# EAGLE design ADIS16209 Practice Board (EAGLE 9.5.0)
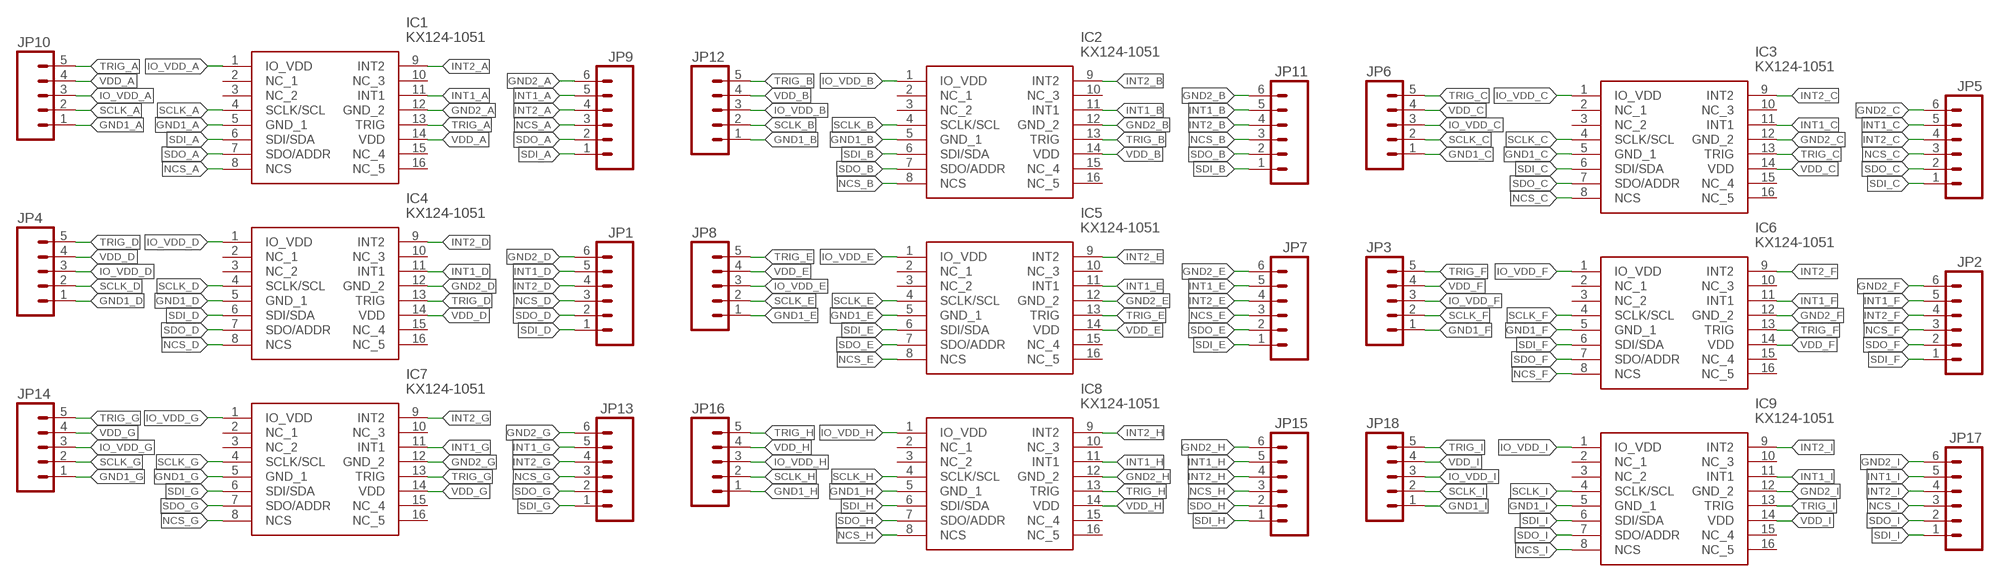
[diagram p0: schematic, sheet 1]

## Parts
IC1  KX124-1051  [3X3LGA]
IC2  KX124-1051  [3X3LGA]
IC3  KX124-1051  [3X3LGA]
IC4  KX124-1051  [3X3LGA]
IC5  KX124-1051  [3X3LGA]
IC6  KX124-1051  [3X3LGA]
IC7  KX124-1051  [3X3LGA]
IC8  KX124-1051  [3X3LGA]
IC9  KX124-1051  [3X3LGA]
JP1  M06  [1X06]
JP2  M06  [1X06]
JP3  M05  [1X05]
JP4  M05  [1X05]
JP5  M06  [1X06]
JP6  M05  [1X05]
JP7  M06  [1X06]
JP8  M05  [1X05]
JP9  M06  [1X06]
JP10  M05  [1X05]
JP11  M06  [1X06]
JP12  M05  [1X05]
JP13  M06  [1X06]
JP14  M05  [1X05]
JP15  M06  [1X06]
JP16  M05  [1X05]
JP17  M06  [1X06]
JP18  M05  [1X05]

## Nets
GND1_A: IC1.5(GND_1) JP10.1
GND1_B: IC2.5(GND_1) JP12.1
GND1_C: IC3.5(GND_1) JP6.1
GND1_D: IC4.5(GND_1) JP4.1
GND1_E: IC5.5(GND_1) JP8.1
GND1_F: IC6.5(GND_1) JP3.1
GND1_G: IC7.5(GND_1) JP14.1
GND1_H: IC8.5(GND_1) JP16.1
GND1_I: IC9.5(GND_1) JP18.1
GND2_A: IC1.12(GND_2) JP9.6
GND2_B: IC2.12(GND_2) JP11.6
GND2_C: IC3.12(GND_2) JP5.6
GND2_D: IC4.12(GND_2) JP1.6
GND2_E: IC5.12(GND_2) JP7.6
GND2_F: IC6.12(GND_2) JP2.6
GND2_G: IC7.12(GND_2) JP13.6
GND2_H: IC8.12(GND_2) JP15.6
GND2_I: IC9.12(GND_2) JP17.6
INT1_A: IC1.11(INT1) JP9.5
INT1_B: IC2.11(INT1) JP11.5
INT1_C: IC3.11(INT1) JP5.5
INT1_D: IC4.11(INT1) JP1.5
INT1_E: IC5.11(INT1) JP7.5
INT1_F: IC6.11(INT1) JP2.5
INT1_G: IC7.11(INT1) JP13.5
INT1_H: IC8.11(INT1) JP15.5
INT1_I: IC9.11(INT1) JP17.5
INT2_A: IC1.9(INT2) JP9.4
INT2_B: IC2.9(INT2) JP11.4
INT2_C: IC3.9(INT2) JP5.4
INT2_D: IC4.9(INT2) JP1.4
INT2_E: IC5.9(INT2) JP7.4
INT2_F: IC6.9(INT2) JP2.4
INT2_G: IC7.9(INT2) JP13.4
INT2_H: IC8.9(INT2) JP15.4
INT2_I: IC9.9(INT2) JP17.4
IO_VDD_A: IC1.1(IO_VDD) JP10.3
IO_VDD_B: IC2.1(IO_VDD) JP12.3
IO_VDD_C: IC3.1(IO_VDD) JP6.3
IO_VDD_D: IC4.1(IO_VDD) JP4.3
IO_VDD_E: IC5.1(IO_VDD) JP8.3
IO_VDD_F: IC6.1(IO_VDD) JP3.3
IO_VDD_G: IC7.1(IO_VDD) JP14.3
IO_VDD_H: IC8.1(IO_VDD) JP16.3
IO_VDD_I: IC9.1(IO_VDD) JP18.3
NCS_A: IC1.8(NCS) JP9.3
NCS_B: IC2.8(NCS) JP11.3
NCS_C: IC3.8(NCS) JP5.3
NCS_D: IC4.8(NCS) JP1.3
NCS_E: IC5.8(NCS) JP7.3
NCS_F: IC6.8(NCS) JP2.3
NCS_G: IC7.8(NCS) JP13.3
NCS_H: IC8.8(NCS) JP15.3
NCS_I: IC9.8(NCS) JP17.3
SCLK_A: IC1.4(SCLK/SCL) JP10.2
SCLK_B: IC2.4(SCLK/SCL) JP12.2
SCLK_C: IC3.4(SCLK/SCL) JP6.2
SCLK_D: IC4.4(SCLK/SCL) JP4.2
SCLK_E: IC5.4(SCLK/SCL) JP8.2
SCLK_F: IC6.4(SCLK/SCL) JP3.2
SCLK_G: IC7.4(SCLK/SCL) JP14.2
SCLK_H: IC8.4(SCLK/SCL) JP16.2
SCLK_I: IC9.4(SCLK/SCL) JP18.2
SDI_A: IC1.6(SDI/SDA) JP9.1
SDI_B: IC2.6(SDI/SDA) JP11.1
SDI_C: IC3.6(SDI/SDA) JP5.1
SDI_D: IC4.6(SDI/SDA) JP1.1
SDI_E: IC5.6(SDI/SDA) JP7.1
SDI_F: IC6.6(SDI/SDA) JP2.1
SDI_G: IC7.6(SDI/SDA) JP13.1
SDI_H: IC8.6(SDI/SDA) JP15.1
SDI_I: IC9.6(SDI/SDA) JP17.1
SDO_A: IC1.7(SDO/ADDR) JP9.2
SDO_B: IC2.7(SDO/ADDR) JP11.2
SDO_C: IC3.7(SDO/ADDR) JP5.2
SDO_D: IC4.7(SDO/ADDR) JP1.2
SDO_E: IC5.7(SDO/ADDR) JP7.2
SDO_F: IC6.7(SDO/ADDR) JP2.2
SDO_G: IC7.7(SDO/ADDR) JP13.2
SDO_H: IC8.7(SDO/ADDR) JP15.2
SDO_I: IC9.7(SDO/ADDR) JP17.2
TRIG_A: IC1.13(TRIG) JP10.5
TRIG_B: IC2.13(TRIG) JP12.5
TRIG_C: IC3.13(TRIG) JP6.5
TRIG_D: IC4.13(TRIG) JP4.5
TRIG_E: IC5.13(TRIG) JP8.5
TRIG_F: IC6.13(TRIG) JP3.5
TRIG_G: IC7.13(TRIG) JP14.5
TRIG_H: IC8.13(TRIG) JP16.5
TRIG_I: IC9.13(TRIG) JP18.5
VDD_A: IC1.14(VDD) JP10.4
VDD_B: IC2.14(VDD) JP12.4
VDD_C: IC3.14(VDD) JP6.4
VDD_D: IC4.14(VDD) JP4.4
VDD_E: IC5.14(VDD) JP8.4
VDD_F: IC6.14(VDD) JP3.4
VDD_G: IC7.14(VDD) JP14.4
VDD_H: IC8.14(VDD) JP16.4
VDD_I: IC9.14(VDD) JP18.4
Unconnected: IC1.2(NC_1) IC1.3(NC_2) IC1.10(NC_3) IC1.15(NC_4) IC1.16(NC_5) IC2.2(NC_1) IC2.3(NC_2) IC2.10(NC_3) IC2.15(NC_4) IC2.16(NC_5) IC3.2(NC_1) IC3.3(NC_2) IC3.10(NC_3) IC3.15(NC_4) IC3.16(NC_5) IC4.2(NC_1) IC4.3(NC_2) IC4.10(NC_3) IC4.15(NC_4) IC4.16(NC_5) IC5.2(NC_1) IC5.3(NC_2) IC5.10(NC_3) IC5.15(NC_4) IC5.16(NC_5) IC6.2(NC_1) IC6.3(NC_2) IC6.10(NC_3) IC6.15(NC_4) IC6.16(NC_5) IC7.2(NC_1) IC7.3(NC_2) IC7.10(NC_3) IC7.15(NC_4) IC7.16(NC_5) IC8.2(NC_1) IC8.3(NC_2) IC8.10(NC_3) IC8.15(NC_4) IC8.16(NC_5) IC9.2(NC_1) IC9.3(NC_2) IC9.10(NC_3) IC9.15(NC_4) IC9.16(NC_5)

## Library data of the parts
IC1-IC9 = samacsys:KX124-1051: TRI-AXIS, USER SELECTABLE +/- 2G, 4G, 8G, DIGITAL (I2C/SPI) OUTPUT, INTEGRATED FIFO/FILO BUFFER, 3X3X0.9MM LGA - KX124-1051 Source: Datasheet <https://drive.google.com/open?id=0B2DMAzfTCVsPTnd2TVZQWHJTTlU>; DESCRIPTION: TRI-AXIS, USER SELECTABLE +/- 2G, 4G, 8G, DIGITAL (I2C/SPI) OUTPUT, INTEGRATED FIFO/FILO BUFFER, 3X3X0.9MM LGA - KX124-1051; HEIGHT: mm; MANUFACTURER_NAME: Kionix; MANUFACTURER_PART_NUMBER: KX124-1051; MOUSER_PART_NUMBER: 912-KX124-1051-FR; MOUSER_PRICE-STOCK: https://www.mouser.com/Search/Refine.aspx?Keyword=912-KX124-1051-FR
JP1 JP2 JP5 JP7 JP9 JP11 JP13 JP15 JP17 = HyTechDevices:M06: Standard 6-pin 0.1" header. NOTES ON THE VARIANTS LOCK and LOCK_LONGPADS... This footprint was designed to help hold the alignment of a through-hole component (i.e. 6-pin header) while soldering it into place. You may notice that each hole has been shifted either up or down by 0.005 of an inch from it's more standard position (which is a perfectly straight line). This slight alteration caused the pins (the squares in the middle) to touch the edges of the holes. Because they are alternating, it causes a "brace" to hold the component in place. 0.005 has proven to be the perfect amount of "off-center" position when using our standard breakaway headers. Although looks a little odd when you look at the bare footprint, once you have a header in there, the alteration is very hard to notice. Also,if you push a header all the way into place, it is covered up entirely on the bottom side. This idea of altering the position of holes to aid alignment will be further integrated into the Sparkfun Library for other footprints. It can help hold any component with 3 or more connection pins. Note: The Sparkfun version includes many other packages including surface mount that may be of future interest. Source: Sparkfun <https://github.com/sparkfun/SparkFun-Eagle-Libraries>
JP3 JP4 JP6 JP8 JP10 JP12 JP14 JP16 JP18 = HyTechDevices:M05: Standard 5-pin 0.1" header. NOTES ON THE VARIANTS LOCK and LOCK_LONGPADS... This footprint was designed to help hold the alignment of a through-hole component (i.e. 5-pin header) while soldering it into place. You may notice that each hole has been shifted either up or down by 0.005 of an inch from it's more standard position (which is a perfectly straight line). This slight alteration caused the pins (the squares in the middle) to touch the edges of the holes. Because they are alternating, it causes a "brace" to hold the component in place. 0.005 has proven to be the perfect amount of "off-center" position when using our standard breakaway headers. Although looks a little odd when you look at the bare footprint, once you have a header in there, the alteration is very hard to notice. Also,if you push a header all the way into place, it is covered up entirely on the bottom side. This idea of altering the position of holes to aid alignment will be further integrated into the Sparkfun Library for other footprints. It can help hold any component with 3 or more connection pins. Note: The Sparkfun version includes many other packages including surface mount that may be of future interest. Source: Sparkfun <https://github.com/sparkfun/SparkFun-Eagle-Libraries>

## Board
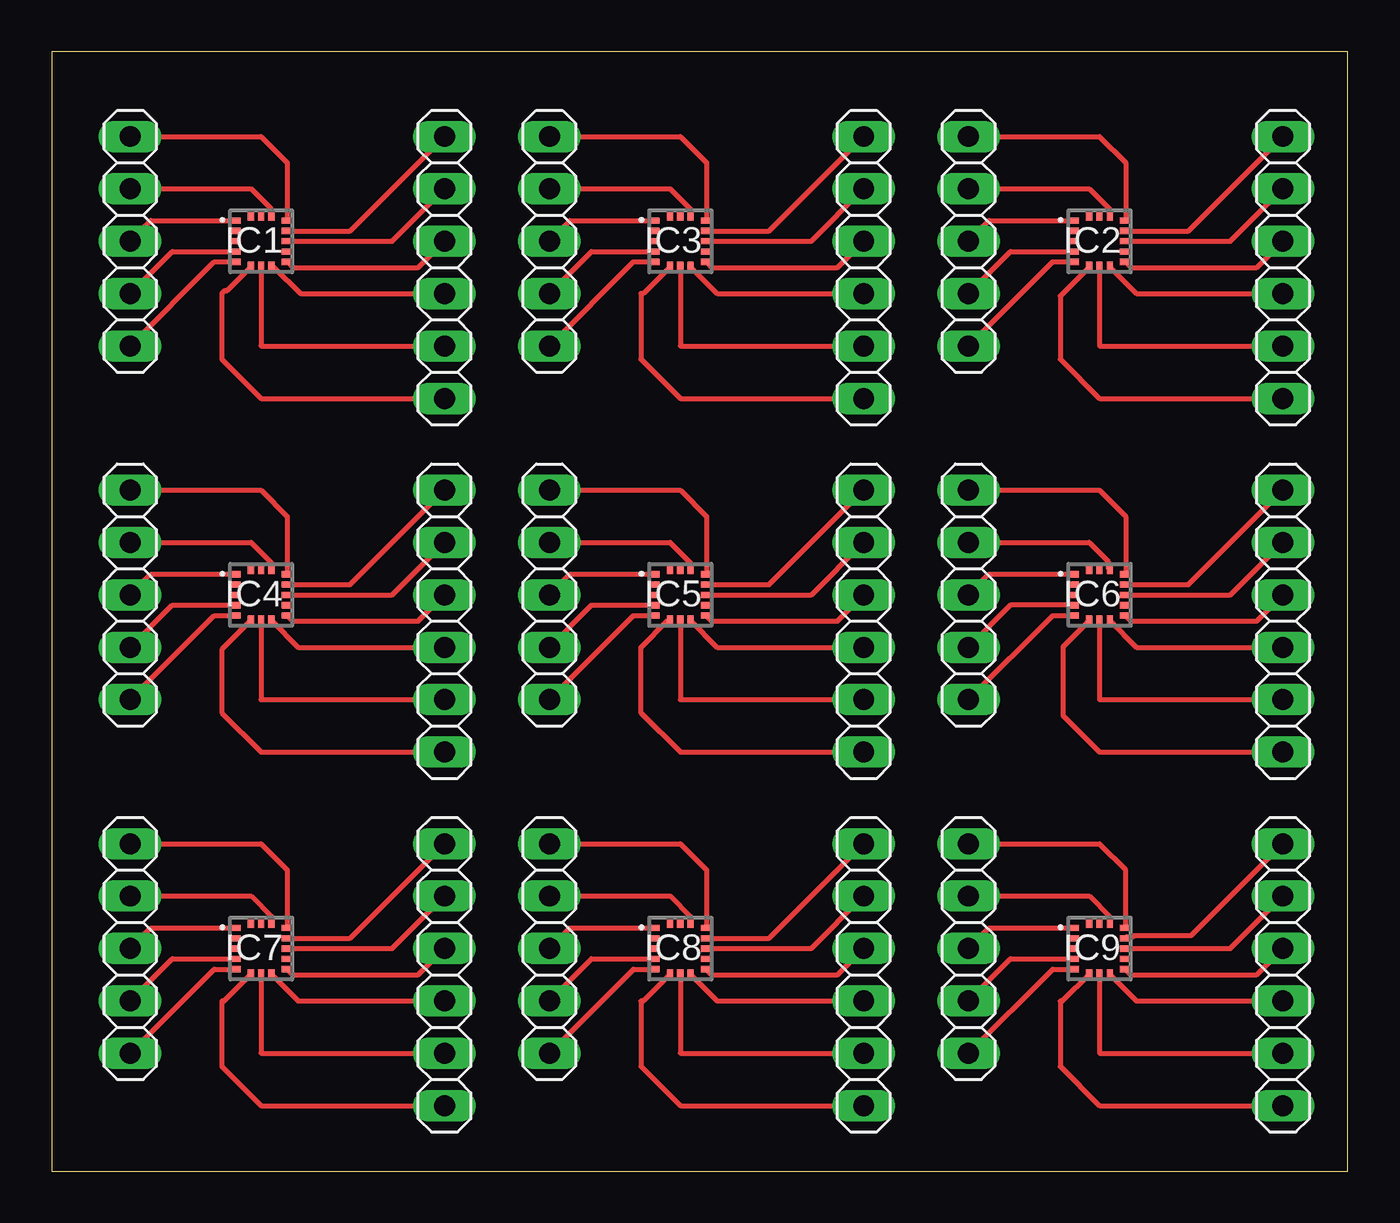
[diagram p1: board, top side]

Size 62.84 x 54.28 mm. Coordinates in mm from the lower left corner, seen from the top.
Outline: 0,0 62.84,0 62.84,54.28 0,54.28 0,0
Copper layers (1*16): Top 0.035mm / dielectric 1.5mm / Bottom 0.035mm
Design rules "DRC Advanced Circuits": minimum track width 6mil, minimum drill 10mil, track to track 6mil, track to pad 6mil, pad to pad 6mil, via to via 6mil, smd to smd 6mil, copper to edge 40mil, drill to drill 6mil, minimum pad ring 10mil, minimum via ring 8mil, stop-mask expansion 4mil, vias tented up to drill 0mil, thermal gap 10mil

### Footprints (pad centres in the part's own frame; a part is rotated, then mirrored left to right if it is on the bottom)
3X3LGA = smd 0.5 x 0.3: 1 -1.25,1; 2 -1.25,0.5; 3 -1.25,0; 4 -1.25,-0.5; 5 -1.25,-1; 9 1.25,-1; 10 1.25,-0.5; 11 1.25,0; 12 1.25,0.5; 13 1.25,1 | smd 0.3 x 0.5: 6 -0.5,-1.25; 7 0,-1.25; 8 0.5,-1.25; 14 0.5,1.25; 15 0,1.25; 16 -0.5,1.25
1X06 = drill 1.016 long: 1 -6.35,0; 2 -3.81,0; 3 -1.27,0; 4 1.27,0; 5 3.81,0; 6 6.35,0
1X05 = drill 1.016 long: 1 -5.08,0; 2 -2.54,0; 3 0,0; 4 2.54,0; 5 5.08,0

### Placement (x,y rotation side)
IC1  10.16,45.09 0 top
IC2  50.8,45.09 0 top
IC3  30.48,45.09 0 top
IC4  10.16,27.94 0 top
IC5  30.48,27.94 0 top
IC6  50.8,27.94 0 top
IC7  10.16,10.8 0 top
IC8  30.48,10.8 0 top
IC9  50.8,10.8 0 top
JP1  19.05,26.67 90 top
JP2  59.69,26.67 90 top
JP3  44.45,27.94 90 top
JP4  3.81,27.94 90 top
JP5  39.37,43.81 90 top
JP6  24.13,45.09 90 top
JP7  39.37,26.67 90 top
JP8  24.13,27.94 90 top
JP9  19.05,43.81 90 top
JP10  3.81,45.09 90 top
JP11  59.69,43.81 90 top
JP12  44.45,45.09 90 top
JP13  19.05,9.52 90 top
JP14  3.81,10.8 90 top
JP15  39.37,9.52 90 top
JP16  24.13,10.8 90 top
JP17  59.69,9.52 90 top
JP18  44.45,10.8 90 top

### Tracks (layer width: path | path; a pad name or v marks a point on that pad's centre or on a via)
GND1_A
  Top 0.254: JP10.1 7.89,44.09 IC1.5
GND1_B
  Top 0.254: JP12.1 48.53,44.09 IC2.5
GND1_C
  Top 0.254: JP6.1 28.21,44.09 IC3.5
GND1_D
  Top 0.254: JP4.1 7.89,26.94 IC4.5
GND1_E
  Top 0.254: JP8.1 28.21,26.94 IC5.5
GND1_F
  Top 0.254: JP3.1 48.53,26.94 IC6.5
GND1_G
  Top 0.254: JP14.1 7.89,9.8 IC7.5
GND1_H
  Top 0.254: JP16.1 28.21,9.8 IC8.5
GND1_I
  Top 0.254: JP18.1 48.53,9.8 IC9.5
GND2_A
  Top 0.254: IC1.12 14.47,45.59 JP9.6
GND2_B
  Top 0.254: IC2.12 55.11,45.59 JP11.6
GND2_C
  Top 0.254: IC3.12 34.79,45.59 JP5.6
GND2_D
  Top 0.254: IC4.12 14.47,28.44 JP1.6
GND2_E
  Top 0.254: IC5.12 34.79,28.44 JP7.6
GND2_F
  Top 0.254: JP2.6 55.11,28.44 IC6.12
GND2_G
  Top 0.254: IC7.12 14.47,11.3 JP13.6
GND2_H
  Top 0.254: IC8.12 34.79,11.3 JP15.6
GND2_I
  Top 0.254: IC9.12 52.12,11.37 52.42,11.37 52.48,11.43 55.25,11.43 JP17.6
INT1_A
  Top 0.254: JP9.5 16.51,45.09 IC1.11
INT1_B
  Top 0.254: IC2.11 57.15,45.09 JP11.5
INT1_C
  Top 0.254: IC3.11 36.83,45.09 JP5.5
INT1_D
  Top 0.254: IC4.11 16.51,27.94 JP1.5
INT1_E
  Top 0.254: IC5.11 36.83,27.94 JP7.5
INT1_F
  Top 0.254: JP2.5 57.15,27.94 IC6.11
INT1_G
  Top 0.254: IC7.11 16.51,10.8 JP13.5
INT1_H
  Top 0.254: IC8.11 36.83,10.8 JP15.5
INT1_I
  Top 0.254: IC9.11 57.15,10.8 JP17.5
INT2_A
  Top 0.254: IC1.9 11.68,43.81 17.78,43.81 JP9.4
INT2_B
  Top 0.254: IC2.9 52.32,43.81 58.42,43.81 JP11.4
INT2_C
  Top 0.254: IC3.9 32,43.81 38.1,43.81 JP5.4
INT2_D
  Top 0.254: IC4.9 11.68,26.67 17.78,26.67 JP1.4
INT2_E
  Top 0.254: IC5.9 32,26.67 38.1,26.67 JP7.4
INT2_F
  Top 0.254: JP2.4 58.42,26.67 52.32,26.67 IC6.9
INT2_G
  Top 0.254: IC7.9 11.68,9.52 17.78,9.52 JP13.4
INT2_H
  Top 0.254: IC8.9 32,9.52 38.1,9.52 JP15.4
INT2_I
  Top 0.254: IC9.9 52.32,9.52 58.42,9.52 JP17.4
IO_VDD_A
  Top 0.254: JP10.3 4.81,46.09 IC1.1
IO_VDD_B
  Top 0.254: JP12.3 45.45,46.09 IC2.1
IO_VDD_C
  Top 0.254: JP6.3 25.13,46.09 IC3.1
IO_VDD_D
  Top 0.254: JP4.3 4.81,28.94 IC4.1
IO_VDD_E
  Top 0.254: JP8.3 25.13,28.94 IC5.1
IO_VDD_F
  Top 0.254: JP3.3 45.45,28.94 IC6.1
IO_VDD_G
  Top 0.254: JP14.3 4.81,11.8 IC7.1
IO_VDD_H
  Top 0.254: JP16.3 25.13,11.8 IC8.1
IO_VDD_I
  Top 0.254: JP18.3 45.45,11.8 IC9.1
NCS_A
  Top 0.254: IC1.8 10.78,43.84 12.06,42.55 JP9.3
NCS_B
  Top 0.254: IC2.8 52.59,42.55 JP11.3
NCS_C
  Top 0.254: IC3.8 32.27,42.55 JP5.3
NCS_D
  Top 0.254: IC4.8 11.95,25.4 JP1.3
NCS_E
  Top 0.254: IC5.8 32.27,25.4 JP7.3
NCS_F
  Top 0.254: IC6.8 52.59,25.4 JP2.3
NCS_G
  Top 0.254: IC7.8 11.95,8.25 JP13.3
NCS_H
  Top 0.254: IC8.8 32.27,8.25 JP15.3
NCS_I
  Top 0.254: IC9.8 52.59,8.25 JP17.3
SCLK_A
  Top 0.254: JP10.2 5.85,44.59 IC1.4
SCLK_B
  Top 0.254: JP12.2 46.49,44.59 IC2.4
SCLK_C
  Top 0.254: JP6.2 26.17,44.59 IC3.4
SCLK_D
  Top 0.254: JP4.2 5.85,27.44 IC4.4
SCLK_E
  Top 0.254: JP8.2 26.17,27.44 IC5.4
SCLK_F
  Top 0.254: IC6.4 46.49,27.44 JP3.2
SCLK_G
  Top 0.254: JP14.2 5.85,10.3 IC7.4
SCLK_H
  Top 0.254: JP16.2 26.17,10.3 IC8.4
SCLK_I
  Top 0.254: JP18.2 46.49,10.3 IC9.4
SDI_A
  Top 0.254: IC1.6 8.51,42.68 8.39,42.68 8.26,42.55 8.26,39.37 10.16,37.47 JP9.1
SDI_B
  Top 0.254: IC2.6 48.9,42.43 48.9,39.37 50.8,37.47 JP11.1
SDI_C
  Top 0.254: IC3.6 28.69,42.55 28.58,42.55 28.58,39.37 30.48,37.47 JP5.1
SDI_D
  Top 0.254: IC4.6 8.26,25.28 8.26,22.23 10.16,20.32 JP1.1
SDI_E
  Top 0.254: JP7.1 30.48,20.32 28.58,22.23 28.58,25.4 29.87,26.69 IC5.6
SDI_F
  Top 0.254: JP2.1 50.8,20.32 49.03,22.09 49.03,25.42 IC6.6
SDI_G
  Top 0.254: IC7.6 8.37,8.25 8.26,8.25 8.26,5.08 10.16,3.18 JP13.1
SDI_H
  Top 0.254: IC8.6 28.69,8.25 28.58,8.25 28.58,5.08 30.48,3.18 JP15.1
SDI_I
  Top 0.254: IC9.6 49.01,8.25 48.9,8.25 48.9,5.08 50.8,3.18 JP17.1
SDO_A
  Top 0.254: IC1.7 10.16,40.01 JP9.2
SDO_B
  Top 0.254: IC2.7 50.8,40.01 JP11.2
SDO_C
  Top 0.254: IC3.7 30.48,40.01 JP5.2
SDO_D
  Top 0.254: IC4.7 10.16,22.86 JP1.2
SDO_E
  Top 0.254: IC5.7 30.48,22.86 JP7.2
SDO_F
  Top 0.254: JP2.2 50.8,22.86 IC6.7
SDO_G
  Top 0.254: IC7.7 10.16,5.71 JP13.2
SDO_H
  Top 0.254: IC8.7 30.48,5.71 JP15.2
SDO_I
  Top 0.254: IC9.7 50.8,5.71 JP17.2
TRIG_A
  Top 0.254: JP10.5 10.16,50.17 11.43,48.89 11.43,46.1 IC1.13
TRIG_B
  Top 0.254: JP12.5 50.8,50.17 52.07,48.89 52.07,46.1 IC2.13
TRIG_C
  Top 0.254: JP6.5 30.48,50.17 31.75,48.89 31.75,46.1 IC3.13
TRIG_D
  Top 0.254: JP4.5 10.16,33.02 11.43,31.75 11.43,28.96 IC4.13
TRIG_E
  Top 0.254: JP8.5 30.48,33.02 31.75,31.75 31.75,28.96 IC5.13
TRIG_F
  Top 0.152: 52.07,28.96 IC6.13
  Top 0.254: 52.07,28.96 52.07,31.75 50.8,33.02 JP3.5
TRIG_G
  Top 0.254: JP14.5 10.16,15.88 11.43,14.61 11.43,11.82 IC7.13
TRIG_H
  Top 0.254: JP16.5 30.48,15.88 31.75,14.61 31.75,11.82 IC8.13
TRIG_I
  Top 0.254: JP18.5 50.8,15.88 52.07,14.61 52.07,11.82 IC9.13
VDD_A
  Top 0.254: IC1.14 10.66,46.63 9.66,47.62 JP10.4
VDD_B
  Top 0.254: IC2.14 51.3,46.63 50.3,47.62 JP12.4
VDD_C
  Top 0.254: IC3.14 30.98,46.63 29.98,47.62 JP6.4
VDD_D
  Top 0.254: IC4.14 10.66,29.48 9.66,30.48 JP4.4
VDD_E
  Top 0.254: IC5.14 30.98,29.48 29.98,30.48 JP8.4
VDD_F
  Top 0.254: IC6.14 51.23,29.26 51.23,29.56 50.3,30.48 JP3.4
VDD_G
  Top 0.254: IC7.14 10.66,12.34 9.66,13.34 JP14.4
VDD_H
  Top 0.254: IC8.14 30.98,12.34 29.98,13.34 JP16.4
VDD_I
  Top 0.254: IC9.14 51.3,12.34 50.3,13.34 JP18.4